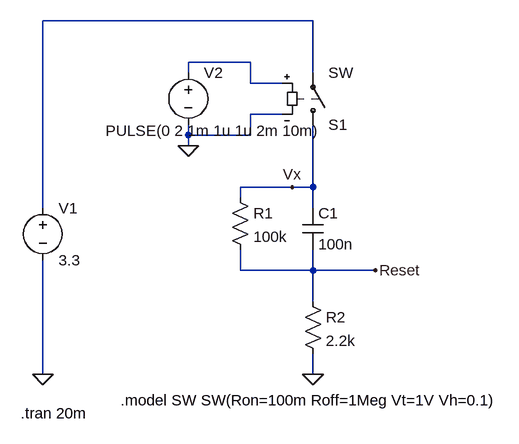
[diagram p0: schematic Fault Reset.asc]
Fault Reset.asc, the LTspice schematic file:
Version 4
SHEET 1 1576 680
WIRE 992 32 576 32
WIRE 896 96 800 96
WIRE 800 112 800 96
WIRE 992 112 992 32
WIRE 896 128 896 96
WIRE 944 128 896 128
WIRE 944 176 896 176
WIRE 800 208 800 192
WIRE 896 208 896 176
WIRE 896 208 800 208
WIRE 800 224 800 208
WIRE 960 288 880 288
WIRE 992 288 992 192
WIRE 992 288 960 288
WIRE 880 304 880 288
WIRE 576 320 576 32
WIRE 992 320 992 288
WIRE 880 416 880 384
WIRE 992 416 992 384
WIRE 992 416 880 416
WIRE 1088 416 992 416
WIRE 992 464 992 416
WIRE 576 576 576 400
WIRE 992 576 992 544
FLAG 992 576 0
FLAG 1088 416 Reset
FLAG 576 576 0
FLAG 800 224 0
FLAG 960 288 Vx
SYMBOL sw 992 208 M180
SYMATTR InstName S1
SYMBOL cap 976 320 R0
SYMATTR InstName C1
SYMATTR Value 100n
SYMBOL res 864 288 R0
SYMATTR InstName R1
SYMATTR Value 100k
SYMBOL res 976 448 R0
SYMATTR InstName R2
SYMATTR Value 2.2k
SYMBOL voltage 576 304 R0
WINDOW 123 0 0 Left 0
WINDOW 39 0 0 Left 0
SYMATTR InstName V1
SYMATTR Value 3.3
SYMBOL voltage 800 96 R0
WINDOW 3 -127 105 Left 2
WINDOW 123 0 0 Left 0
WINDOW 39 0 0 Left 0
SYMATTR InstName V2
SYMATTR Value PULSE(0 2 1m 1u 1u 2m 10m)
TEXT 696 616 Left 2 !.model SW SW(Ron=100m Roff=1Meg Vt=1V Vh=0.1)
TEXT 542 636 Left 2 !.tran 20m

The netlist it stands for:
* Fault Reset.asc
S1 Vx N001 N002 0 SW
C1 Vx Reset 100n
R1 Vx Reset 100k
R2 Reset 0 2.2k
V1 N001 0 3.3
V2 N002 0 PULSE(0 2 1m 1u 1u 2m 10m)
.model SW SW(Ron=100m Roff=1Meg Vt=1V Vh=0.1)
.tran 20m
.backanno
.end